# Altium schematic sheet power.SchDoc
size A4; SheetNumber: 3; SheetTotal: 4
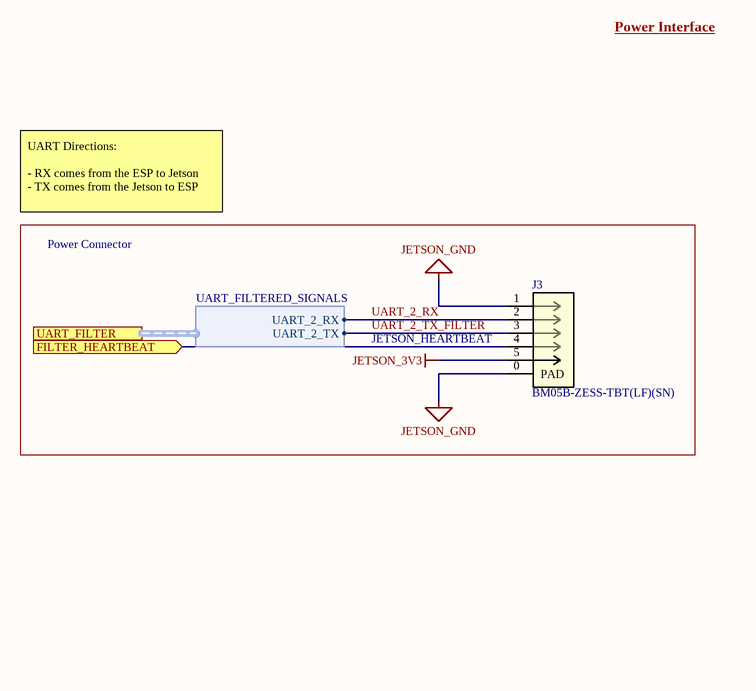
[diagram p0: power.SchDoc]

## Parts
J3  BM05B-ZESS-TBT(LF)(SN)  [JST ZE SMT 5POS]

## Ports
FILTER_HEARTBEAT (in), UART_FILTER (harness UART_FILTERED_SIGNALS)

## Harnesses
UART_FILTERED_SIGNALS: UART_2_TX, UART_2_RX

## Nets
JETSON_3V3: J3.5
JETSON_GND: J3.0(PAD) J3.1
FILTER_HEARTBEAT: J3.4 ; port FILTER_HEARTBEAT
UART_2_RX: J3.2 ; port UART_FILTER.UART_2_RX
UART_2_TX_FILTER: J3.3 ; port UART_FILTER.UART_2_TX

## Notes on the sheet
- Power Interface
- UART Directions:
  - RX comes from the ESP to Jetson
  - TX comes from the Jetson to ESP
- Power Connector
- JETSON_HEARTBEAT

## Library data of the parts
J3 = CN 5POS JST ZE SMT: CONN HEADER VERT SMD 5POS ZE; Part Number: CN 5POS JST ZE SMT; Supplier 1: Digi-Key; Supplier Part Number 1: 455-2383-1-ND; Supplier URL 1: https://www.digikey.ca/en/products/detail/jst-sales-america-inc/BM05B-ZESS-TBT-LF-SN/1886989?s=N4IgTCBcDaIEIFkAMBWOBaAWgUQMq-QBU5CAKAGQDEBKU3AOWpAF0BfIA; Pin Count: 5; Manufacturer Part Number 1: BM05B-ZESS-TBT(LF)(SN)